# Altium project GP2Y_v3_eth.PrjPcb
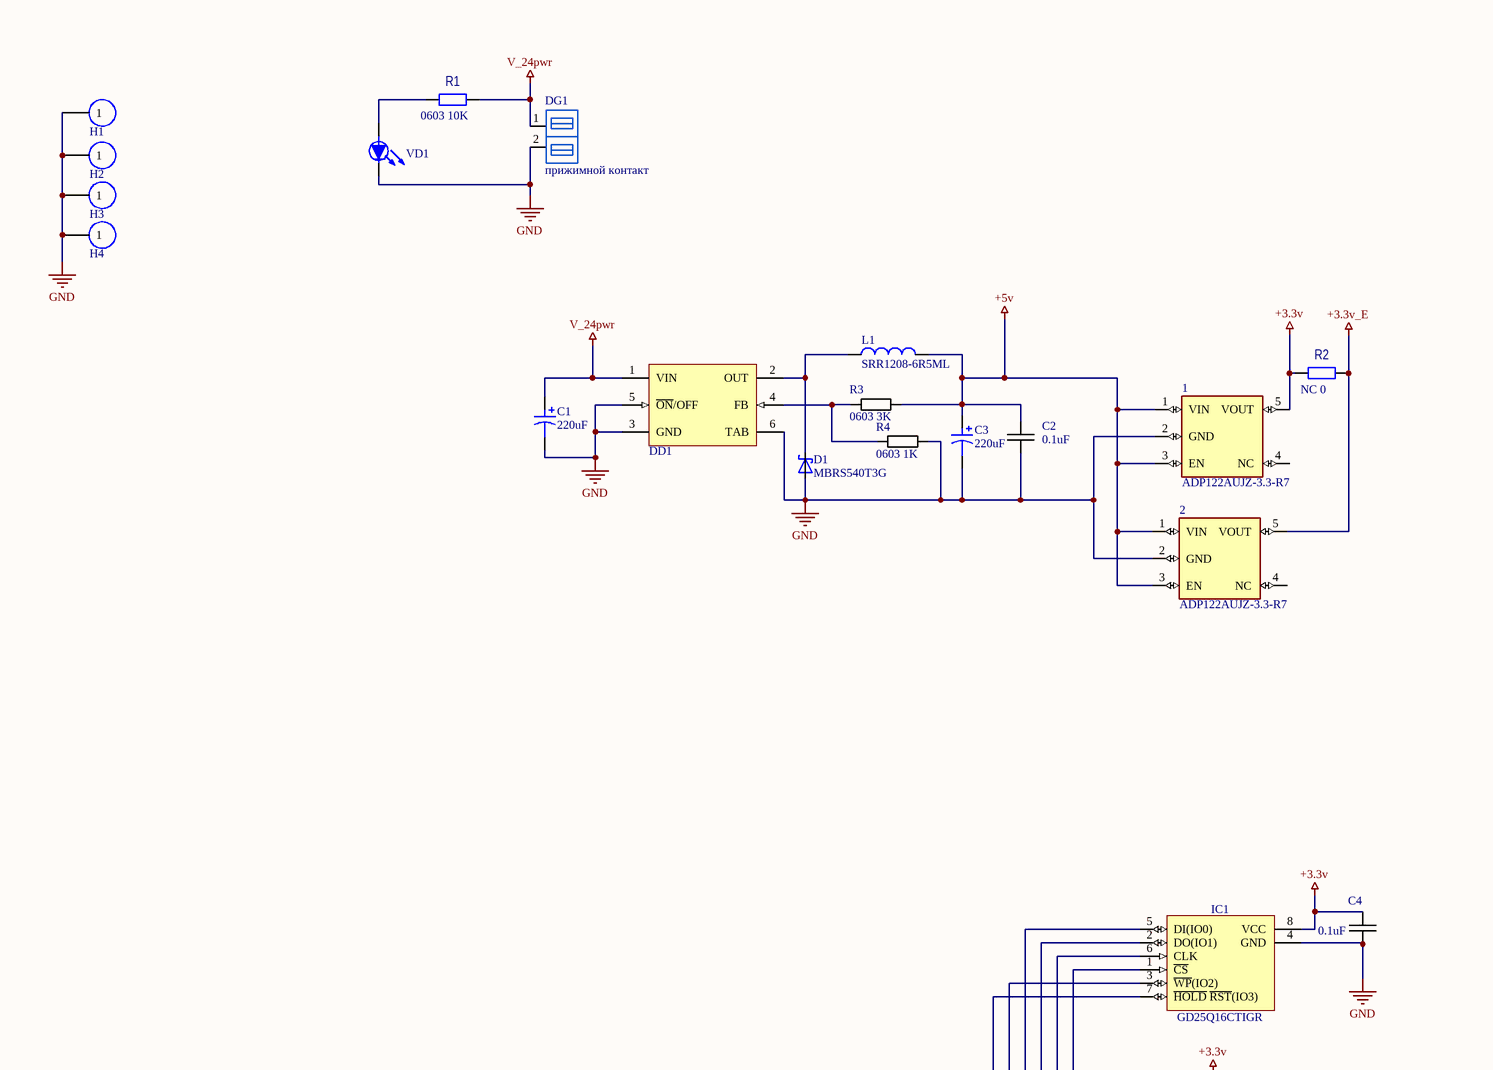
[diagram p0: GP2Y_v3_eth.SchDoc, top left]
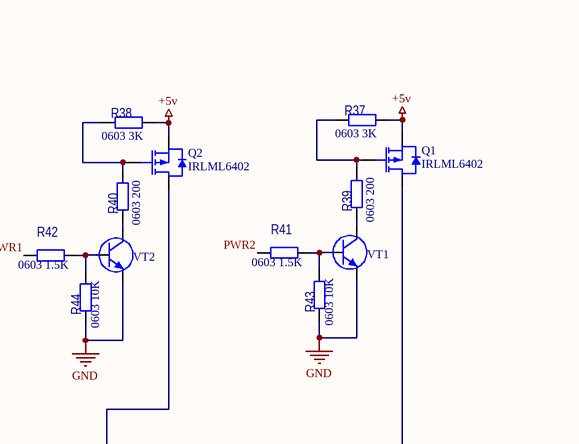
[diagram p1: GP2Y_v3_eth.SchDoc, top right]
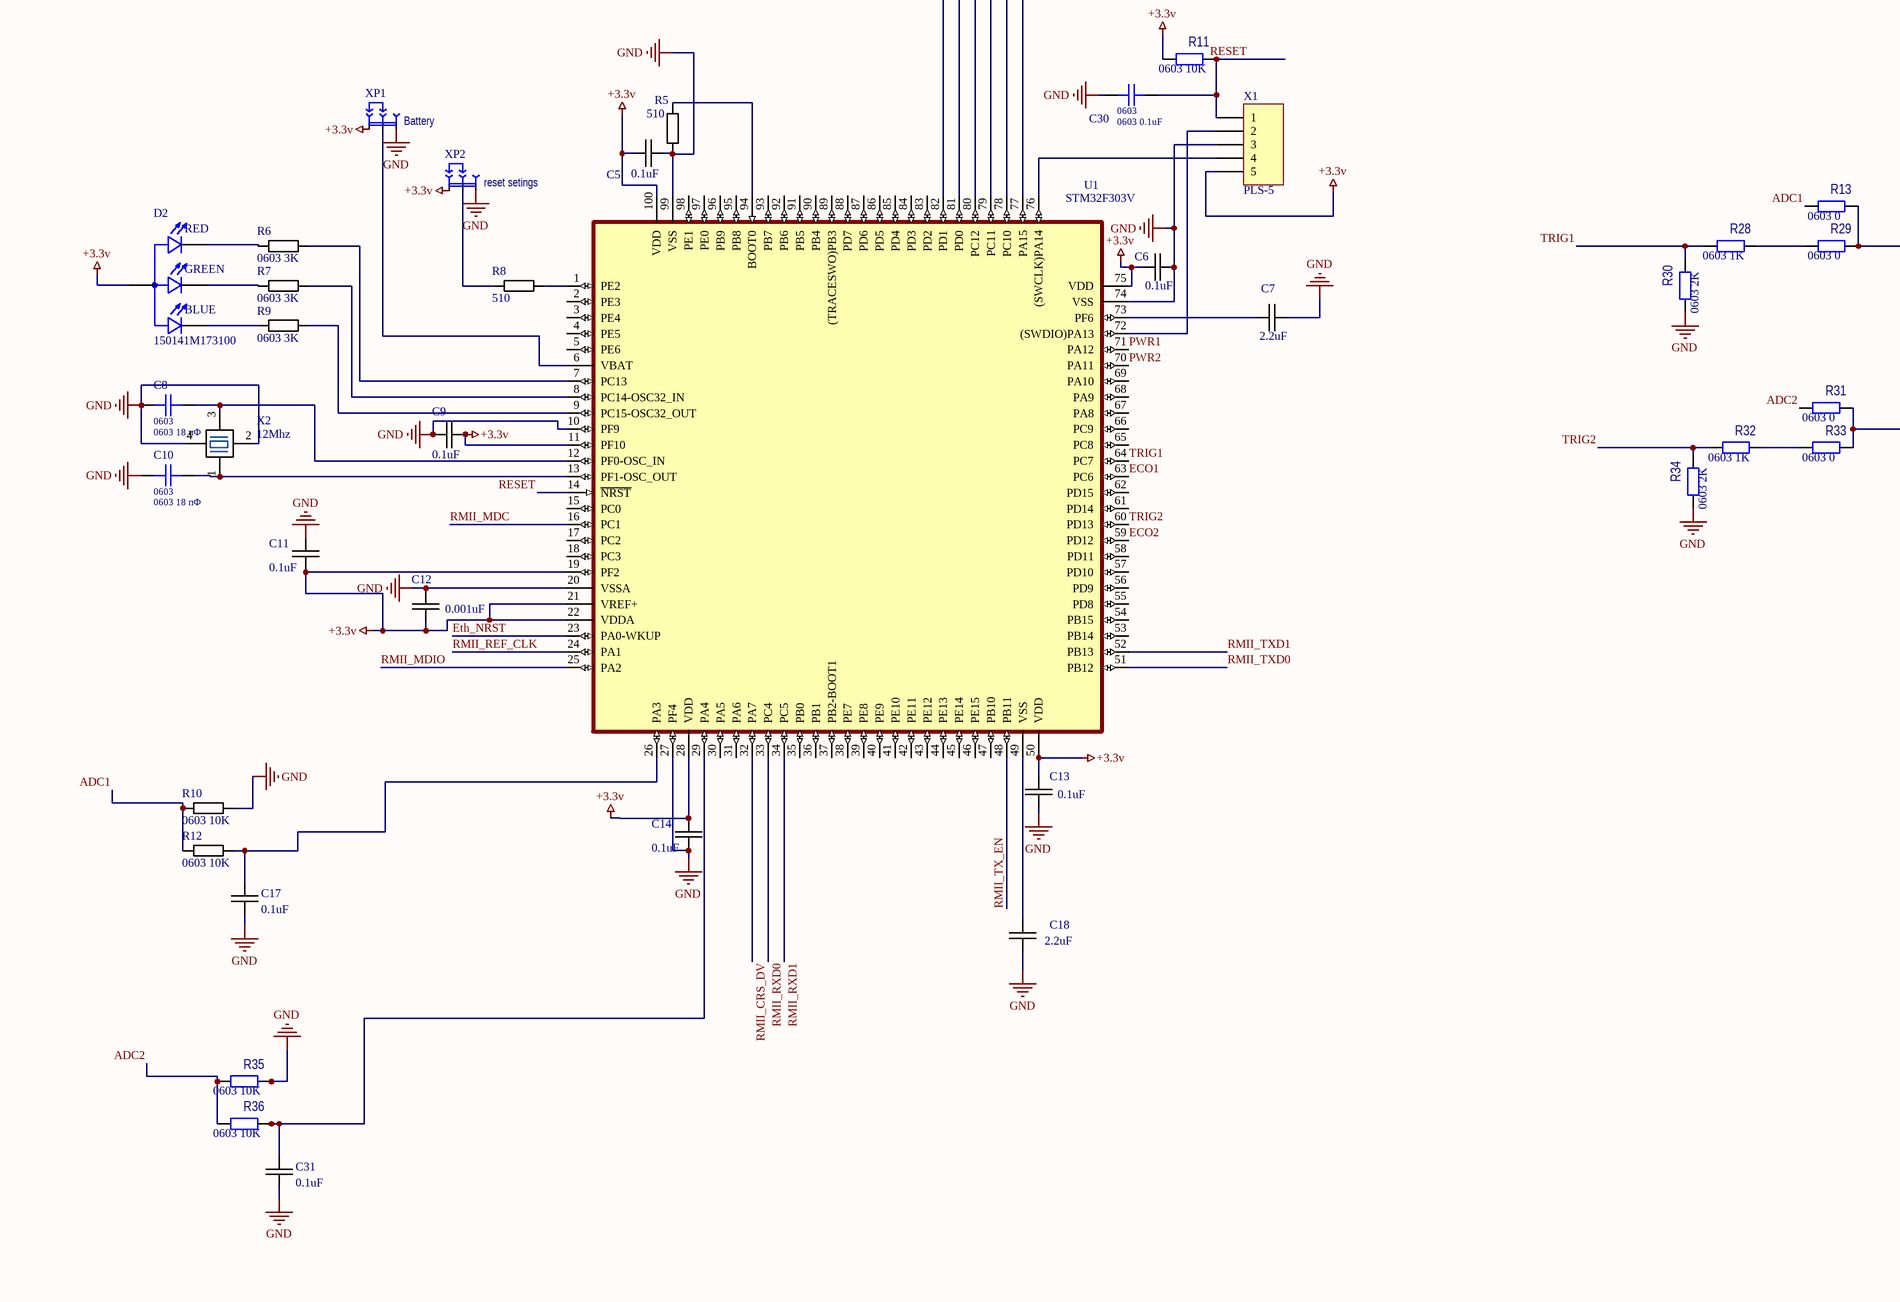
[diagram p2: GP2Y_v3_eth.SchDoc, bottom left]
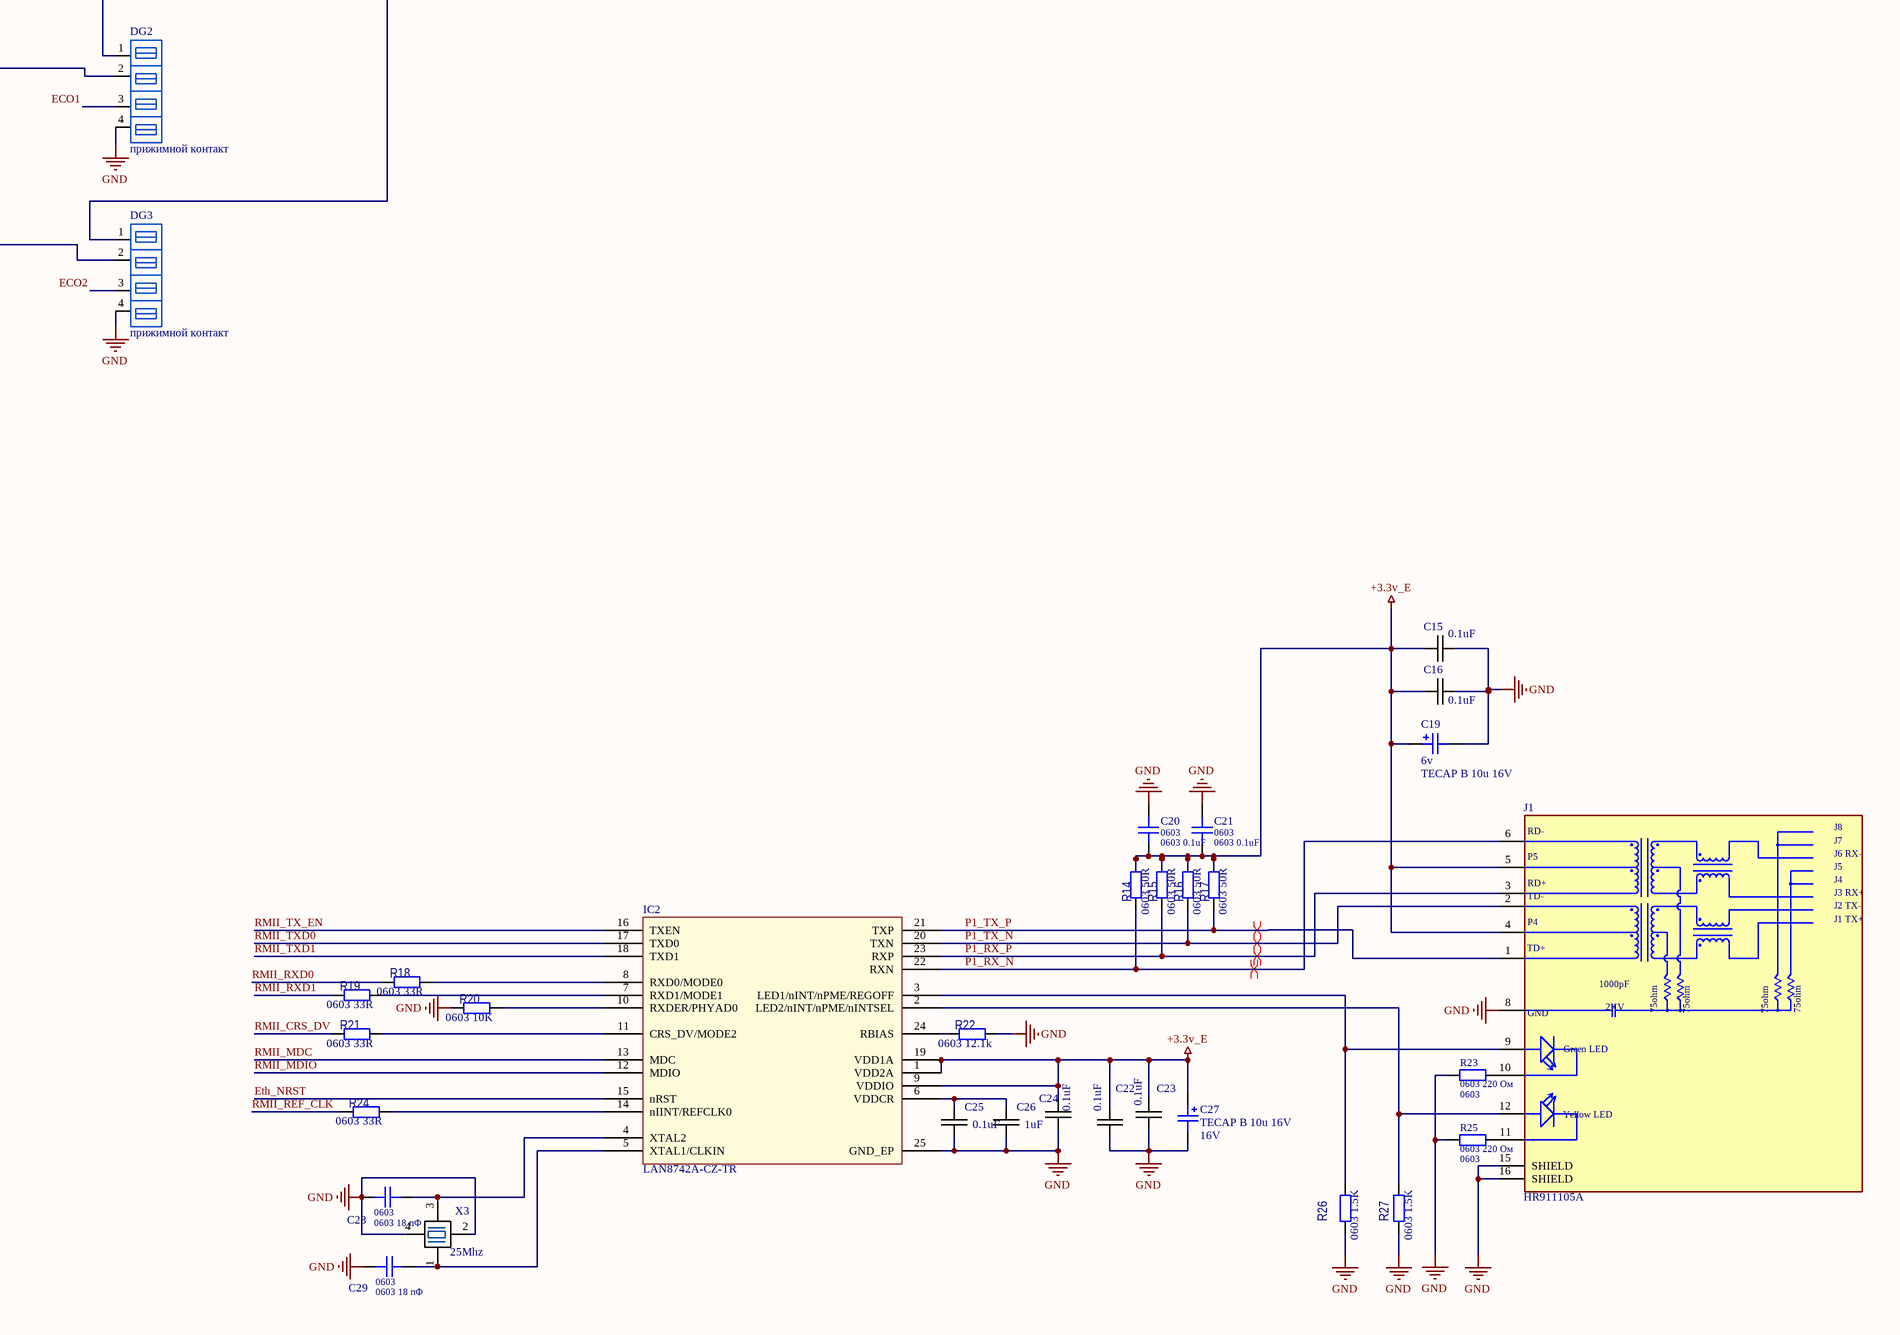
[diagram p3: GP2Y_v3_eth.SchDoc, bottom right]
1 sheet, 102 parts. Net scope: global (net labels, ports and power ports of the same name join across sheets).
Board file: GP2Y_v3_eth.PcbDoc

## Sheet GP2Y_v3_eth.SchDoc
size A1

### Parts
1  ADP122AUJZ-3.3-R7  [TSOT23-5L]
2  ADP122AUJZ-3.3-R7  [TSOT23-5L]
C1  value 220uF  [ECR 10x13mm]  (hidden comment: 220uF 50v)
C2  0.1uF  [CAPACITOR 0603]
C3  value 220uF  [ECR 10x13mm]  (hidden comment: 220uF 50v)
C4  0.1uF  [CAPACITOR 0603]
C5  0.1uF  [CAPACITOR 0603]
C6  0.1uF  [CAPACITOR 0603]
C7  2.2uF  [CAPACITOR 0805]
C8  Type: 0603  [CAPCHIP0603]  (hidden comment: 0603 18 пФ)
C9  0.1uF  [CAPACITOR 0603]
C10  Type: 0603  [CAPCHIP0603]  (hidden comment: 0603 18 пФ)
C11  0.1uF  [CAPACITOR 0603]
C12  0.001uF  [CAPACITOR 0603]
C13  0.1uF  [CAPACITOR 0603]
C14  0.1uF  [CAPACITOR 0603]
C15  0.1uF  [CAPACITOR 0603]
C16  0.1uF  [CAPACITOR 0603]
C17  0.1uF  [CAPACITOR 0603]
C18  2.2uF  [CAPACITOR 0805]
C19  value TECAP B 10u 16V  Voltage: 6v  [TECAP B]  (hidden comment: Cap T)
C20  Type: 0603  [CAPCHIP0603]  (hidden comment: 0603 0.1uF)
C21  Type: 0603  [CAPCHIP0603]  (hidden comment: 0603 0.1uF)
C22  0.1uF  [CAPACITOR 0603]
C23  0.1uF  [CAPACITOR 0603]
C24  0.1uF  [CAPACITOR 0603]
C25  0.1uF  [CAPACITOR 0603]
C26  1uF  [CAPACITOR 0603]
C27  Voltage: 16V  [TECAP B]  (hidden comment: TECAP B 10u 16V)
C28  Type: 0603  [CAPCHIP0603]  (hidden comment: 0603 18 пФ)
C29  Type: 0603  [CAPCHIP0603]  (hidden comment: 0603 18 пФ)
C30  Type: 0603  [CAPCHIP0603]  (hidden comment: 0603 0.1uF)
C31  0.1uF  [CAPACITOR 0603]
D1  MBRS540T3G  [DIOM7958X213N]
D2  150141M173100  [LED_150141M173100]
DD1  LM2596S-ADJ  [TO-263]  (value not drawn)
DG1  прижимной контакт  [dg250-2.5-2]
DG2  прижимной контакт  [dg250-2.5-4]
DG3  прижимной контакт  [dg250-2.5-4]
H1  Hole  [Hole 3.5]  (value not drawn)
H2  Hole  [Hole 3.5]  (value not drawn)
H3  Hole  [Hole 3.5]  (value not drawn)
H4  Hole  [Hole 3.5]  (value not drawn)
IC1  GD25Q16CTIGR  [NSO8]
IC2  LAN8742A-CZ-TR  [LAN8742A]
J1  HR911105A  [HANRUN_HR911105A]
L1  SRR1208-6R5ML  [SRR1208]
Q1  IRLML6402  [SOT23]
Q2  IRLML6402  [SOT23]
R1  0603 10K  [RESCHIP0603]
R2  NC 0  [RESCHIP0603]
R3  0603 3K  [Resistor 0603]
R4  0603 1K  [Resistor 0603]
R5  510  [Resistor 0603]
R6  0603 3K  [Resistor 0603]
R7  0603 3K  [Resistor 0603]
R8  510  [Resistor 0603]
R9  0603 3K  [Resistor 0603]
R10  0603 10K  [Resistor 0603]
R11  0603 10K  [RESCHIP0603]
R12  0603 10K  [Resistor 0603]
R13  0603 0  [RESCHIP0603]
R14  0603 50R  [RESCHIP0603]
R15  0603 50R  [RESCHIP0603]
R16  0603 50R  [RESCHIP0603]
R17  0603 50R  [RESCHIP0603]
R18  0603 33R  [RESCHIP0603]
R19  0603 33R  [RESCHIP0603]
R20  0603 10K  [RESCHIP0603]
R21  0603 33R  [RESCHIP0603]
R22  0603 12.1k  [RESCHIP0603]
R23  Type: 0603  [RESCHIP0603]  (hidden comment: 0603 220 Ом)
R24  0603 33R  [RESCHIP0603]
R25  Type: 0603  [RESCHIP0603]  (hidden comment: 0603 220 Ом)
R26  0603 1.5K  [RESCHIP0603]
R27  0603 1.5K  [RESCHIP0603]
R28  0603 1K  [RESCHIP0603]
R29  0603 0  [RESCHIP0603]
R30  0603 2K  [RESCHIP0603]
R31  0603 0  [RESCHIP0603]
R32  0603 1K  [RESCHIP0603]
R33  0603 0  [RESCHIP0603]
R34  0603 2K  [RESCHIP0603]
R35  0603 10K  [RESCHIP0603]
R36  0603 10K  [RESCHIP0603]
R37  0603 3K  [RESCHIP0603]
R38  0603 3K  [RESCHIP0603]
R39  0603 200  [RESCHIP0603]
R40  0603 200  [RESCHIP0603]
R41  0603 1.5K  [RESCHIP0603]
R42  0603 1.5K  [RESCHIP0603]
R43  0603 10K  [RESCHIP0603]
R44  0603 10K  [RESCHIP0603]
U1  STM32F303V  [QFP50P1600X1600X160-100N]
VD1  one color  [0805-]  (value not drawn)
VT1  MMBT4401LT1  [SOT23]  (value not drawn)
VT2  MMBT4401LT1  [SOT23]  (value not drawn)
X1  PLS-5  [PLS-5-3D]
X2  12Mhz  [XTAL_3.2_2.5]
X3  25Mhz  [XTAL_3.2_2.5]
XP1  Battery  [ZL201-3]
XP2  reset setings  [ZL201-3]

### Nets
+3.3v: 1.5(VOUT) C4.1 C5.1 C6.1 C9.2 C11.2 C12.2 C13.1 C14.1 D2.1(A) IC1.8(VCC) R2.1 R11.1 U1.11(PF10) U1.19(PF2) U1.21(VREF+) U1.22(VDDA) U1.28(VDD) U1.50(VDD) U1.75(VDD) U1.100(VDD) X1.5 XP1.1 XP2.1
+3.3v_E: 2.5(VOUT) C15.1 C16.1 C19.1 C20.1 C21.1 C22.1 C23.2 C24.1 C27.1 IC2.1(VDD2A) IC2.9(VDDIO) IC2.19(VDD1A) J1.4(P4) J1.5(P5) R2.2 R14.2 R15.2 R16.2 R17.2
+5v: 1.1(VIN) 1.3(EN) 2.1(VIN) 2.3(EN) C2.2 C3.1 L1.P$2 Q1.2(S) Q2.2(S) R3.2 R37.2 R38.2
GND: 1.2(GND) 2.2(GND) C1.2 C2.1 C3.2 C4.2 C5.2 C6.2 C7.2 C8.1 C9.1 C10.1 C11.1 C12.1 C13.2 C14.2 C15.2 C16.2 C17.1 C18.1 C19.2 C20.2 C21.2 C22.2 C23.1 C24.2 C25.2 C26.2 C27.2 C28.1 C29.1 C30.1 C31.1 D1.A DD1.3(GND) DD1.5(~{ON}/OFF) DD1.6(TAB) DG1.2 DG2.4 DG3.4 H1.1 H2.1 H3.1 H4.1 IC1.4(GND) IC2.25(GND_EP) J1.8(GND) J1.15(SHIELD) J1.16(SHIELD) R4.2 R5.2 R10.1 R20.1 R22.2 R23.1 R25.1 R26.1 R27.1 R30.1 R34.1 R35.2 R43.1 R44.1 U1.10(PF9) U1.20(VSSA) U1.27(PF4) U1.74(VSS) U1.99(VSS) VD1.K(k) VT1.2(E) VT2.2(E) X1.3 X2.2 X2.4 X3.2 X3.4 XP1.3 XP2.3
V_24pwr: C1.1 DD1.1(VIN) DG1.1 R1.2
ADC1: R10.2 R12.2 R13.1
ADC2: R31.1 R35.1 R36.1
ECO1: DG2.3 U1.63(PC6)
ECO2: DG3.3 U1.59(PD12)
Eth_NRST: IC2.15(nRST) U1.23(PA0-WKUP)
P1_RX_N: IC2.22(RXN) J1.6(RD-) R14.1
P1_RX_P: IC2.23(RXP) J1.3(RD+) R15.1
P1_TX_N: IC2.20(TXN) J1.2(TD-) R16.1
P1_TX_P: IC2.21(TXP) J1.1(TD+) R17.1
PWR1: R42.1 U1.71(PA12)
PWR2: R41.1 U1.70(PA11)
RESET: C30.2 R11.2 U1.14(~{NRST}) X1.1
RMII_CRS_DV: R21.1 U1.32(PA7)
RMII_MDC: IC2.13(MDC) U1.16(PC1)
RMII_MDIO: IC2.12(MDIO) U1.25(PA2)
RMII_REF_CLK: R24.1 U1.24(PA1)
RMII_RXD0: R18.1 U1.33(PC4)
RMII_RXD1: R19.1 U1.34(PC5)
RMII_TX_EN: IC2.16(TXEN) U1.48(PB11)
RMII_TXD0: IC2.17(TXD0) U1.51(PB12)
RMII_TXD1: IC2.18(TXD1) U1.52(PB13)
TRIG1: R28.1 R30.2 U1.64(PC7)
TRIG2: R32.1 R34.2 U1.60(PD13)
NetC7_1: C7.1 U1.73(PF6)
NetC8_2: C8.2 U1.12(PF0-OSC_IN) X2.3
NetC10_2: C10.2 U1.13(PF1-OSC_OUT) X2.1
NetC17_2: C17.2 R12.1 U1.26(PA3)
NetC18_2: C18.2 U1.49(VSS)
NetC25_1: C25.1 C26.1 IC2.6(VDDCR)
NetC28_2: C28.2 IC2.4(XTAL2) X3.3
NetC29_2: C29.2 IC2.5(XTAL1/CLKIN) X3.1
NetC31_2: C31.2 R36.2 U1.29(PA4)
NetD1_C: D1.C DD1.2(OUT) L1.P$1
NetD2_2: D2.2(B_C) R9.2
NetD2_3: D2.3(R_C) R6.2
NetD2_4: D2.4(G_C) R7.2
NetDD1_4: DD1.4(FB) R3.1 R4.1
NetDG2_1: DG2.1 Q2.3(D)
NetDG2_2: DG2.2 R13.2 R29.2
NetDG3_1: DG3.1 Q1.3(D)
NetDG3_2: DG3.2 R31.2 R33.2
NetIC1_1: IC1.1(~{CS}) U1.77(PA15)
NetIC1_2: IC1.2(DO(IO1)) U1.79(PC11)
NetIC1_3: IC1.3(~{WP}(IO2)) U1.81(PD0)
NetIC1_5: IC1.5(DI(IO0)) U1.80(PC12)
NetIC1_6: IC1.6(CLK) U1.78(PC10)
NetIC1_7: IC1.7(~{HOLD}_~{RST}(IO3)) U1.82(PD1)
NetIC2_2: IC2.2(LED2/nINT/nPME/nINTSEL) J1.12(YA) R27.2
NetIC2_3: IC2.3(LED1/nINT/nPME/REGOFF) J1.9(GA) R26.2
NetIC2_7: IC2.7(RXD1/MODE1) R19.2
NetIC2_8: IC2.8(RXD0/MODE0) R18.2
NetIC2_10: IC2.10(RXDER/PHYAD0) R20.2
NetIC2_11: IC2.11(CRS_DV/MODE2) R21.2
NetIC2_14: IC2.14(nIINT/REFCLK0) R24.2
NetIC2_24: IC2.24(RBIAS) R22.1
NetJ1_10: J1.10(GC) R23.2
NetJ1_11: J1.11(YC) R25.2
NetQ1_1: Q1.1(G) R37.1 R39.2
NetQ2_1: Q2.1(G) R38.1 R40.2
NetR1_1: R1.1 VD1.A(a)
NetR5_1: R5.1 U1.94(BOOT0)
NetR6_1: R6.1 U1.7(PC13)
NetR7_1: R7.1 U1.8(PC14-OSC32_IN)
NetR8_1: R8.1 XP2.2
NetR8_2: R8.2 U1.1(PE2)
NetR9_1: R9.1 U1.9(PC15-OSC32_OUT)
NetR28_2: R28.2 R29.1
NetR32_2: R32.2 R33.1
NetR39_1: R39.1 VT1.3(C)
NetR40_1: R40.1 VT2.3(C)
NetR41_2: R41.2 R43.2 VT1.1(B)
NetR42_2: R42.2 R44.2 VT2.1(B)
NetU1_6: U1.6(VBAT) XP1.2
NetU1_72: U1.72((SWDIO)PA13) X1.2
NetU1_76: U1.76((SWCLK)PA14) X1.4

Not connected (* = marked no-connect by the designer): 1 4(NC); 2 4(NC); U1 2(PE3) 3(PE4) 4(PE5) 5(PE6) 15(PC0) 17(PC2) 18(PC3) 30(PA5) 31(PA6) 35(PB0) 36(PB1) 37(PB2-BOOT1) 38(PE7) 39(PE8) 40(PE9) 41(PE10) 42(PE11) 43(PE12) 44(PE13) 45(PE14) 46(PE15) 47(PB10) 53(PB14) 54(PB15) 55(PD8) 56(PD9) 57(PD10) 58(PD11) 61(PD14) 62(PD15) 65(PC8) 66(PC9) 67(PA8) 68(PA9) 69(PA10) 83(PD2) 84(PD3) 85(PD4) 86(PD5) 87(PD6) 88(PD7) 89((TRACESWO)PB3) 90(PB4) 91(PB5) 92(PB6) 93(PB7) 95(PB8) 96(PB9) 97(PE0) 98(PE1)

### Layout directives
differential pair: P1_RX_N, P1_RX_P, P1_TX_N, P1_TX_P

### Notes on the sheet
- (in symbol 150141M173100) RED; GREEN; BLUE
- (in symbol HR911105A) J8; J7; J6 RX-; J5; J4; J3 RX+; J2 TX-; J1 TX+; 1000pF; 2KV; 75ohm; Green LED; Yellow LED

### Library data of the parts
1 2 = ADP122AUJZ-3.3-R7: Linear Voltage Regulator IC 1 Output 300mA TSOT-5; MF: Analog Devices; MP: ADP122AUJZ-3.3-R7; Value: ADP122AUJZ-3.3-R7; SnapEDA_Link: https://www.snapeda.com/parts/ADP122AUJZ-3.3-R7/Analog%20Devices%20Inc./view-part/231148/?ref=snap; Price: None; Availability: Unavailable; Package: TSOT-5 Analog Devices
C1 C3 = Cap Pol: Polarized Capacitor (Rad); Voltage: 50; Type: Type; URL: http://www.hitano.com.tw/PDF/ECR_081225.pdf
C2 C4-C6 C9 C11-C17 C22-C25 C31 = Capasitor: Value: 0603 0.1uF
C7 C18 = Capasitor: Value: 0805 2.2uF
C8 C10 C20 C21 C28-C30 = Cap C: Керамическтй конденсатор SMD C0603
  C8 C10 C28 C29: Value: 0603 18 пФ
  C20 C21 C30: Value: 0603 0.1uF
C19 C27 = Cap T: Solid Tantalum Surface Mount Capacitors
  C19: Type: Type
  C27: Value: TECAP B 10u 16V; Type: TECAP B
C26 = Capasitor: Value: 0603 1uF
D1 = MBRS540T3G: Diode Schottky 40V 5A Surface Mount SMC; MF: ON Semiconductor; SnapEDA_Link: https://www.snapeda.com/parts/MBRS540T3G/ON%20Semiconductor/view-part/78777/?ref=snap; MP: MBRS540T3G; Availability: Unavailable; Price: None; Value: MBRS540T3G; Package: DO-214 ON Semiconductor
D2 = 150141M173100: Red, Green, Blue _RGB_ 625nm Red, 520nm Green, 470nm Blue LED Indication - Discrete 2V Red, 3.2V Green, 3.2V Blue 1411 _3528 Metric_; MF: Wurth Electronics; Value: RGB; SnapEDA_Link: https://www.snapeda.com/parts/150141M173100/Wurth%20Electronics%20Inc./view-part/281733/?ref=snap; Price: None; MP: 150141M173100; Package: 1411 WÃ¼rth Elektronik; Availability: Unavailable
DD1 = LM2596S-ADJ: SIMPLE SWITCHER® Power Converter 150 KHz 3A Step-Down Voltage Regulator, 5-pin TO-263; Manufacturer: National Semiconductor; Published: 13.04.2012; Publisher: Reukov A.V.; PartNumber: LM2596S-ADJ; CompType: Switcher; ComponentLink1URL: http://www.national.com/ds/LM/LM2596.pdf; ComponentLink2URL: http://www.national.com/pf/LM/LM2596.html; ComponentLink3URL: http://www.national.com/packaging/folders/ts5b.html; Value: LM2596S-ADJ
DG1 = dg250-2.5-2
DG2 DG3 = dg250-2.5-4
IC1 = W25Q128FVEIG: 128M-bit Serial Flash Memory with uniform 4KB sectors and Dual/Quad SPI and QPI; Value: GD25Q16CTIGR
J1 = HR911105A: HR911105A Ethernet Interface Arduino Platform Evaluation Expansion Board; MF: DFRobot; Package: None; Availability: Unavailable; MP: HR911105A; Value: HR911105A; SnapEDA_Link: https://www.snapeda.com/parts/HR911105A/DFRobot/view-part/214807/?ref=snap; Price: None
L1 = SRR1208-6R5ML: 6.5ÂµH Shielded Wirewound Inductor 6A 18mOhm Max Nonstandard; MF: Bourns; Availability: Unavailable; SnapEDA_Link: https://www.snapeda.com/parts/SRR1208-6R5ML/Bourns/view-part/353452/?ref=snap; Value: *; Package: Nonstandard Bourns; MP: SRR1208-6R5ML; Price: None
Q1 Q2 = P-ch_SOT23: 20V P-Channel Enhancement Mode MOSFET; Published: 17-Dec-2003; DatasheetVersion: Jul-99; PackageVersion: 1996; PackageReference: SOT23; Publisher: Altium Limited; PackageDescription: SOT-23; 3 Leads; Body 3.1 x 2.5 mm, inc. leads (LxW max), Alternate Lead Configuration; ComponentLink1Description: Manufacturer Link; ComponentLink1URL: http://www.zetex.com/; ComponentLink2Description: Datasheet; ComponentLink2URL: www.zetex.com/3.0/pdf/ZXM61P02F.pdf
R1 R2 R11 R13-R22 R24 R26-R44 = Res: Резистор; Tolerance_Percent: {Tolerance_Percent}; Class: Электронные компоненты; SubClass: Резисторы; Power_W: {Power_W}; Installation: {Installation}; Ordering_Information: {Ordering_Information}; Body: {Body}; Pins: 2
  R1 R11 R20 R35 R36 R43 R44: Value: 0603 10K
  R2: Value: NC 0
  R13 R29 R31 R33: Value: 0603 0
  R14-R17: Value: 0603 50R
  R18 R19 R21 R24: Value: 0603 33R
  R22: Value: 0603 12.1k
  R26 R27 R41 R42: Value: 0603 1.5K
  R28 R32: Value: 0603 1K
  R30 R34: Value: 0603 2K
  R37 R38: Value: 0603 3K
  R39 R40: Value: 0603 200
R3 R4 R6 R7 R9 R10 R12 = Resistor
  R3 R6 R7 R9: Value: 0603 3K
  R4: Value: 0603 1K
  R10 R12: Value: 0603 10K
R5 R8 = Resistor: Value: 0603 510R
R23 R25 = Res: Резистор SMD R0603; Tolerance: %; PWR: Value; Value: 0603 220 Ом
U1 = STM32F303V: ARMÂ® CortexÂ®-M4 STM32F3 Microcontroller IC 32-Bit 72MHz 100-LQFP (14x14); MF: STMicroelectronics; Value: STM32F407VE; Price: None; Availability: Unavailable; Package: LQFP-100 STMicroelectronics; MP: STM32F303V
VD1 = LED SMD: Class: Электронные компоненты; SubClass: Светодиоды; Value: 0805; Pitch_mm: {Pitch_mm}; Ordering_Information: {Ordering_Information}; Luminous_intensity_mcd: {Luminous_intensity_mcd}; Diameter_mm: {Diameter_mm}; Color: {Color}; Installation: {Installation}; Body: {Body}; Pins: 2
VT1 VT2 = BC846: NPN Bipolar Transistor; Published: 17.04.2012; Publisher: Reukov A.V.
X1 = PLS-5: Header, 5-Pin; LatestRevisionDate: 17-Jul-2002; LatestRevisionNote: Re-released for DXP Platform.; Publisher: Altium Limited
X2 X3 = XTAL 2-pin
XP1 = Select jump: Class: Электронные компоненты; SubClass: Разъемы; Pitch_mm: {Pitch_mm}; Installation: DIP; Ordering_Information: {Ordering_Information}; Type_of_connector: {Type_of_connector}; Pins: 3; Value: Battery
XP2 = Select jump: Ter120; Class: Электронные компоненты; SubClass: Разъемы; Pitch_mm: {Pitch_mm}; Installation: DIP; Ordering_Information: {Ordering_Information}; Type_of_connector: {Type_of_connector}; Pins: 3; Value: reset setings
IC2 = LAN8742A-CZ-TR: Value: LAN8742A-CZ-TR